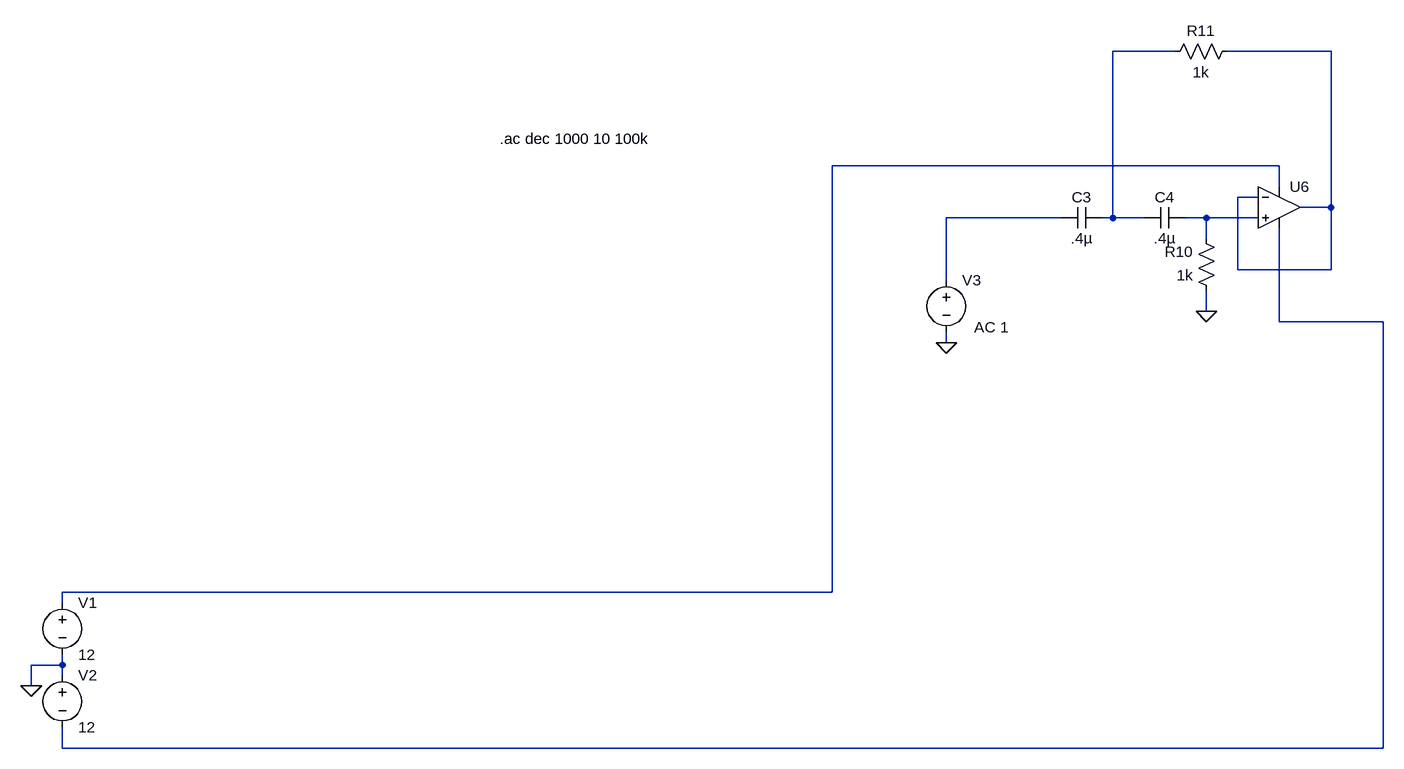
[diagram p0: schematic Multiplicador teoricoxx.asc]
Multiplicador teoricoxx.asc, the LTspice schematic file:
Version 4
SHEET 1 1432 680
WIRE 688 -1104 592 -1104
WIRE 928 -1104 768 -1104
WIRE 848 -928 160 -928
WIRE 848 -896 848 -928
WIRE 816 -880 784 -880
WIRE 928 -864 928 -1104
WIRE 928 -864 880 -864
WIRE 512 -848 336 -848
WIRE 592 -848 592 -1104
WIRE 592 -848 576 -848
WIRE 640 -848 592 -848
WIRE 736 -848 704 -848
WIRE 816 -848 736 -848
WIRE 736 -816 736 -848
WIRE 784 -768 784 -880
WIRE 928 -768 928 -864
WIRE 928 -768 784 -768
WIRE 336 -752 336 -848
WIRE 736 -704 736 -736
WIRE 848 -688 848 -832
WIRE 1008 -688 848 -688
WIRE 336 -656 336 -672
WIRE 160 -272 160 -928
WIRE 160 -272 -1024 -272
WIRE -1024 -256 -1024 -272
WIRE -1024 -160 -1024 -176
WIRE -1024 -160 -1072 -160
WIRE -1024 -144 -1024 -160
WIRE -1072 -128 -1072 -160
WIRE -1024 -32 -1024 -64
WIRE 1008 -32 1008 -688
WIRE 1008 -32 -1024 -32
FLAG -1072 -128 0
FLAG 336 -656 0
FLAG 736 -704 0
SYMBOL voltage -1024 -272 R0
WINDOW 123 0 0 Left 2
WINDOW 39 0 0 Left 2
SYMATTR InstName V1
SYMATTR Value 12
SYMBOL voltage -1024 -160 R0
WINDOW 123 0 0 Left 2
WINDOW 39 0 0 Left 2
SYMATTR InstName V2
SYMATTR Value 12
SYMBOL res 752 -720 R180
WINDOW 0 36 76 Left 2
WINDOW 3 36 40 Left 2
SYMATTR InstName R10
SYMATTR Value 1k
SYMBOL cap 576 -864 R90
WINDOW 0 0 32 VBottom 2
WINDOW 3 32 32 VTop 2
SYMATTR InstName C3
SYMATTR Value .4µ
SYMBOL cap 704 -864 R90
WINDOW 0 0 32 VBottom 2
WINDOW 3 32 32 VTop 2
SYMATTR InstName C4
SYMATTR Value .4µ
SYMBOL res 672 -1088 R270
WINDOW 0 32 56 VTop 2
WINDOW 3 0 56 VBottom 2
SYMATTR InstName R11
SYMATTR Value 1k
SYMBOL Opamps\\UniversalOpamp2 848 -864 R0
SYMATTR InstName U6
SYMBOL voltage 336 -768 R0
WINDOW 123 43 88 Left 2
WINDOW 39 0 0 Left 0
SYMATTR InstName V3
SYMATTR Value ""
SYMATTR Value2 AC 1
TEXT -351 -970 Left 2 !.ac dec 1000 10 100k

The netlist it stands for:
* Multiplicador teoricoxx.asc
V1 N003 0 12
V2 0 N006 12
R10 0 N005 1k
C3 N001 N004 .4µ
C4 N005 N001 .4µ
R11 N001 N002 1k
XU6 N005 N002 N003 N006 N002 level.2 Avol=1Meg GBW=10Meg Slew=10Meg ilimit=25m rail=0 Vos=0 phimargin=45 en=0 enk=0 in=0 ink=0 Rin=500Meg  ; pins IN+ IN- V+ V- OUT
V3 N004 0 AC 1
.ac dec 1000 10 100k
.lib UniversalOpamps2.sub
.backanno
.end